# EAGLE schematic node6-gfe (EAGLE 6.5.0)

## Sheet 1 of 2: STM32, ENET
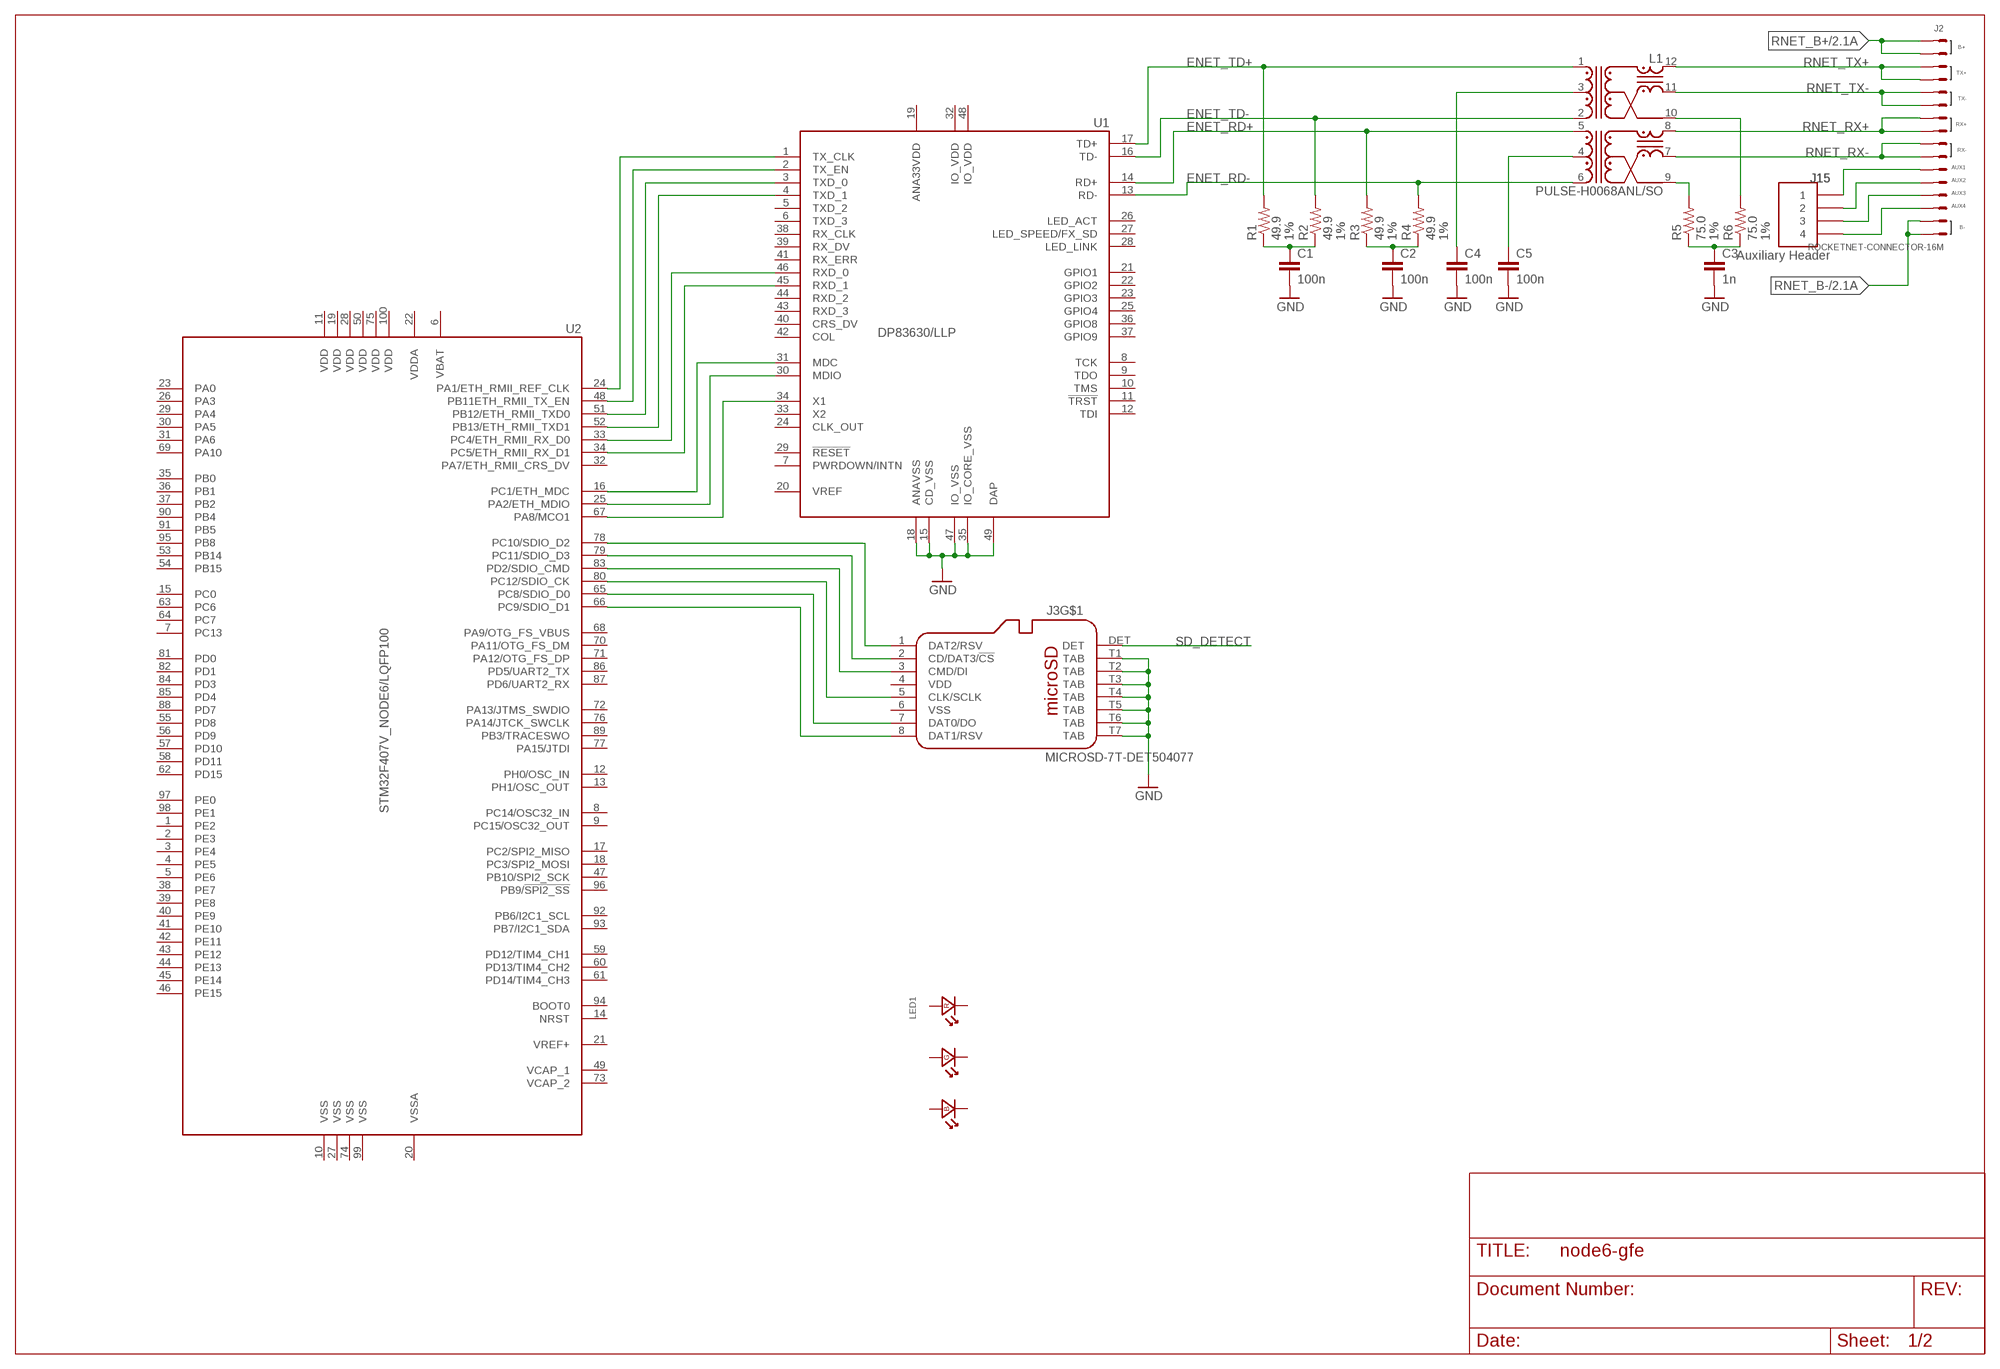
[diagram p0: schematic, sheet 1]

### Parts
C1  100n  C-EU0402-B-NOSILK  [0402-B-NOSILK]
C2  100n  C-EU0402-B-NOSILK  [0402-B-NOSILK]
C3  1n  C-EU0402-B-NOSILK  [0402-B-NOSILK]
C4  100n  C-EU0402-B-NOSILK  [0402-B-NOSILK]
C5  100n  C-EU0402-B-NOSILK  [0402-B-NOSILK]
J2  ROCKETNET-CONNECTOR-16M  [ROCKETNET-M-16]
J3  MICROSD-7T-DET504077  [MOLEX_504077-1891]
J15  Auxiliary Header  1.27MM_HDR_1X4  [INLINE]
L1  PULSE-H0068ANL/SO  [PULSE-H0068ANL]
LED1  LED_RGB_PLCC-6  [PLCC-6]
R1  49.9  R-US_0402-B-NOSILK  [0402-B-NOSILK]
R2  49.9  R-US_0402-B-NOSILK  [0402-B-NOSILK]
R3  49.9  R-US_0402-B-NOSILK  [0402-B-NOSILK]
R4  49.9  R-US_0402-B-NOSILK  [0402-B-NOSILK]
R5  75.0  R-US_0402-B-NOSILK  [0402-B-NOSILK]
R6  75.0  R-US_0402-B-NOSILK  [0402-B-NOSILK]
U1  DP83630/LLP  [QFN50P700X700X80-49N]
U2  STM32F407V_NODE6/LQFP100  [QFP50P1600X1600X160-100N]

### Nets
ENET_RD+: L1.5(TD+) R3.2 U1.14(RD+)
ENET_RD-: L1.6(TD-) R4.2 U1.13(RD-)
ENET_TD+: L1.1(RD+) R1.2 U1.17(TD+)
ENET_TD-: L1.2(RD-) R2.2 U1.16(TD-)
GND [PWR]: C1.2 C2.2 C3.2 C4.2 C5.2 J3.T1(TAB) J3.T2(TAB) J3.T3(TAB) J3.T4(TAB) J3.T5(TAB) J3.T6(TAB) J3.T7(TAB) U1.15(CD_VSS) U1.18(ANAVSS) U1.35(IO_CORE_VSS) U1.47(IO_VSS) U1.49(DAP) ; also sheet 2
N$3: U1.1(TX_CLK) U2.24(PA1/ETH_RMII_REF_CLK)
N$5: C1.1 R1.1 R2.1
N$7: L1.9(TXCT) R5.2
N$8: C2.1 R3.1 R4.1
N$9: L1.10(RXCT) R6.2
N$10: C3.1 R5.1 R6.1
N$11: C4.1 L1.3(RDCT)
N$12: C5.1 L1.4(TDCT)
N$13: U1.2(TX_EN) U2.48(PB11ETH_RMII_TX_EN)
N$14: U1.3(TXD_0) U2.51(PB12/ETH_RMII_TXD0)
N$15: U1.4(TXD_1) U2.52(PB13/ETH_RMII_TXD1)
N$16: U1.46(RXD_0) U2.33(PC4/ETH_RMII_RX_D0)
N$17: U1.45(RXD_1) U2.34(PC5/ETH_RMII_RX_D1)
N$18: U1.34(X1) U2.67(PA8/MCO1)
N$19: U1.30(MDIO) U2.25(PA2/ETH_MDIO)
N$20: U1.31(MDC) U2.16(PC1/ETH_MDC)
RNET_AUX1: J2.A1(AUX1) J15.1
RNET_AUX2: J2.A2(AUX2) J15.2
RNET_AUX3: J2.A3(AUX3) J15.3
RNET_AUX4: J2.A4(AUX4) J15.4
RNET_B+: J2.B+@15(B+) J2.B+@16(B+) ; also sheet 2
RNET_B-: J2.B-@1(B-) J2.B-@2(B-) ; also sheet 2
RNET_RX+: J2.R+@5(RX+) J2.R+@7(RX+) L1.8(TX+)
RNET_RX-: J2.R-@3(RX-) J2.R-@4(RX-) L1.7(TX-)
RNET_TX+: J2.T+@13(TX+) J2.T+@14(TX+) L1.12(RX+)
RNET_TX-: J2.T-@9(TX-) J2.T-@11(TX-) L1.11(RX-)
SD_CLK: J3.5(CLK/SCLK) U2.80(PC12/SDIO_CK)
SD_CMD: J3.3(CMD/DI) U2.83(PD2/SDIO_CMD)
SD_DAT0: J3.7(DAT0/DO) U2.65(PC8/SDIO_D0)
SD_DAT1: J3.8(DAT1/RSV) U2.66(PC9/SDIO_D1)
SD_DAT2: J3.1(DAT2/RSV) U2.78(PC10/SDIO_D2)
SD_DAT3: J3.2(CD/DAT3/!CS) U2.79(PC11/SDIO_D3)
SD_DETECT: J3.DET
Unconnected: LED1.1(R:A) LED1.2(G:K) LED1.3(G:A) LED1.4(B:A) LED1.5(B:K) LED1.6(R:K) U1.5(TXD_2) U1.6(TXD_3) U1.7(PWRDOWN/INTN) U1.8(TCK) U1.9(TDO) U1.10(TMS) U1.11(!TRST) U1.12(TDI) U1.20(VREF) U1.21(GPIO1) U1.22(GPIO2) U1.23(GPIO3) U1.24(CLK_OUT) U1.25(GPIO4) U1.26(LED_ACT) U1.27(LED_SPEED/FX_SD) U1.28(LED_LINK) U1.29(!RESET) U1.33(X2) U1.36(GPIO8) U1.37(GPIO9) U1.38(RX_CLK) U1.39(RX_DV) U1.40(CRS_DV) U1.41(RX_ERR) U1.42(COL) U1.43(RXD_3) U1.44(RXD_2) U2.1(PE2) U2.2(PE3) U2.3(PE4) U2.4(PE5) U2.5(PE6) U2.6(VBAT) U2.7(PC13) U2.8(PC14/OSC32_IN) U2.9(PC15/OSC32_OUT) U2.10(VSS) U2.11(VDD) U2.12(PH0/OSC_IN) U2.13(PH1/OSC_OUT) U2.14(NRST) U2.15(PC0) U2.17(PC2/SPI2_MISO) U2.18(PC3/SPI2_MOSI) U2.19(VDD) U2.20(VSSA) U2.21(VREF+) U2.22(VDDA) U2.23(PA0) U2.26(PA3) U2.27(VSS) U2.28(VDD) U2.29(PA4) U2.30(PA5) U2.31(PA6) U2.32(PA7/ETH_RMII_CRS_DV) U2.35(PB0) U2.36(PB1) U2.37(PB2) U2.38(PE7) U2.39(PE8) U2.40(PE9) U2.41(PE10) U2.42(PE11) U2.43(PE12) U2.44(PE13) U2.45(PE14) U2.46(PE15) U2.47(PB10/SPI2_SCK) U2.49(VCAP_1) U2.50(VDD) U2.53(PB14) U2.54(PB15) U2.55(PD8) U2.56(PD9) U2.57(PD10) U2.58(PD11) U2.59(PD12/TIM4_CH1) U2.60(PD13/TIM4_CH2) U2.61(PD14/TIM4_CH3) U2.62(PD15) U2.63(PC6) U2.64(PC7) U2.68(PA9/OTG_FS_VBUS) U2.69(PA10) U2.70(PA11/OTG_FS_DM) U2.71(PA12/OTG_FS_DP) U2.72(PA13/JTMS_SWDIO) U2.73(VCAP_2) U2.74(VSS) U2.75(VDD) U2.76(PA14/JTCK_SWCLK) U2.77(PA15/JTDI) U2.81(PD0) U2.82(PD1) U2.84(PD3) U2.85(PD4) U2.86(PD5/UART2_TX) U2.87(PD6/UART2_RX) U2.88(PD7) U2.89(PB3/TRACESWO) U2.90(PB4) U2.91(PB5) U2.92(PB6/I2C1_SCL) U2.93(PB7/I2C1_SDA) U2.94(BOOT0) U2.95(PB8) U2.96(PB9/!SPI2_SS) U2.97(PE0) U2.98(PE1) U2.99(VSS) U2.100(VDD)

## Sheet 2 of 2: Power Supply
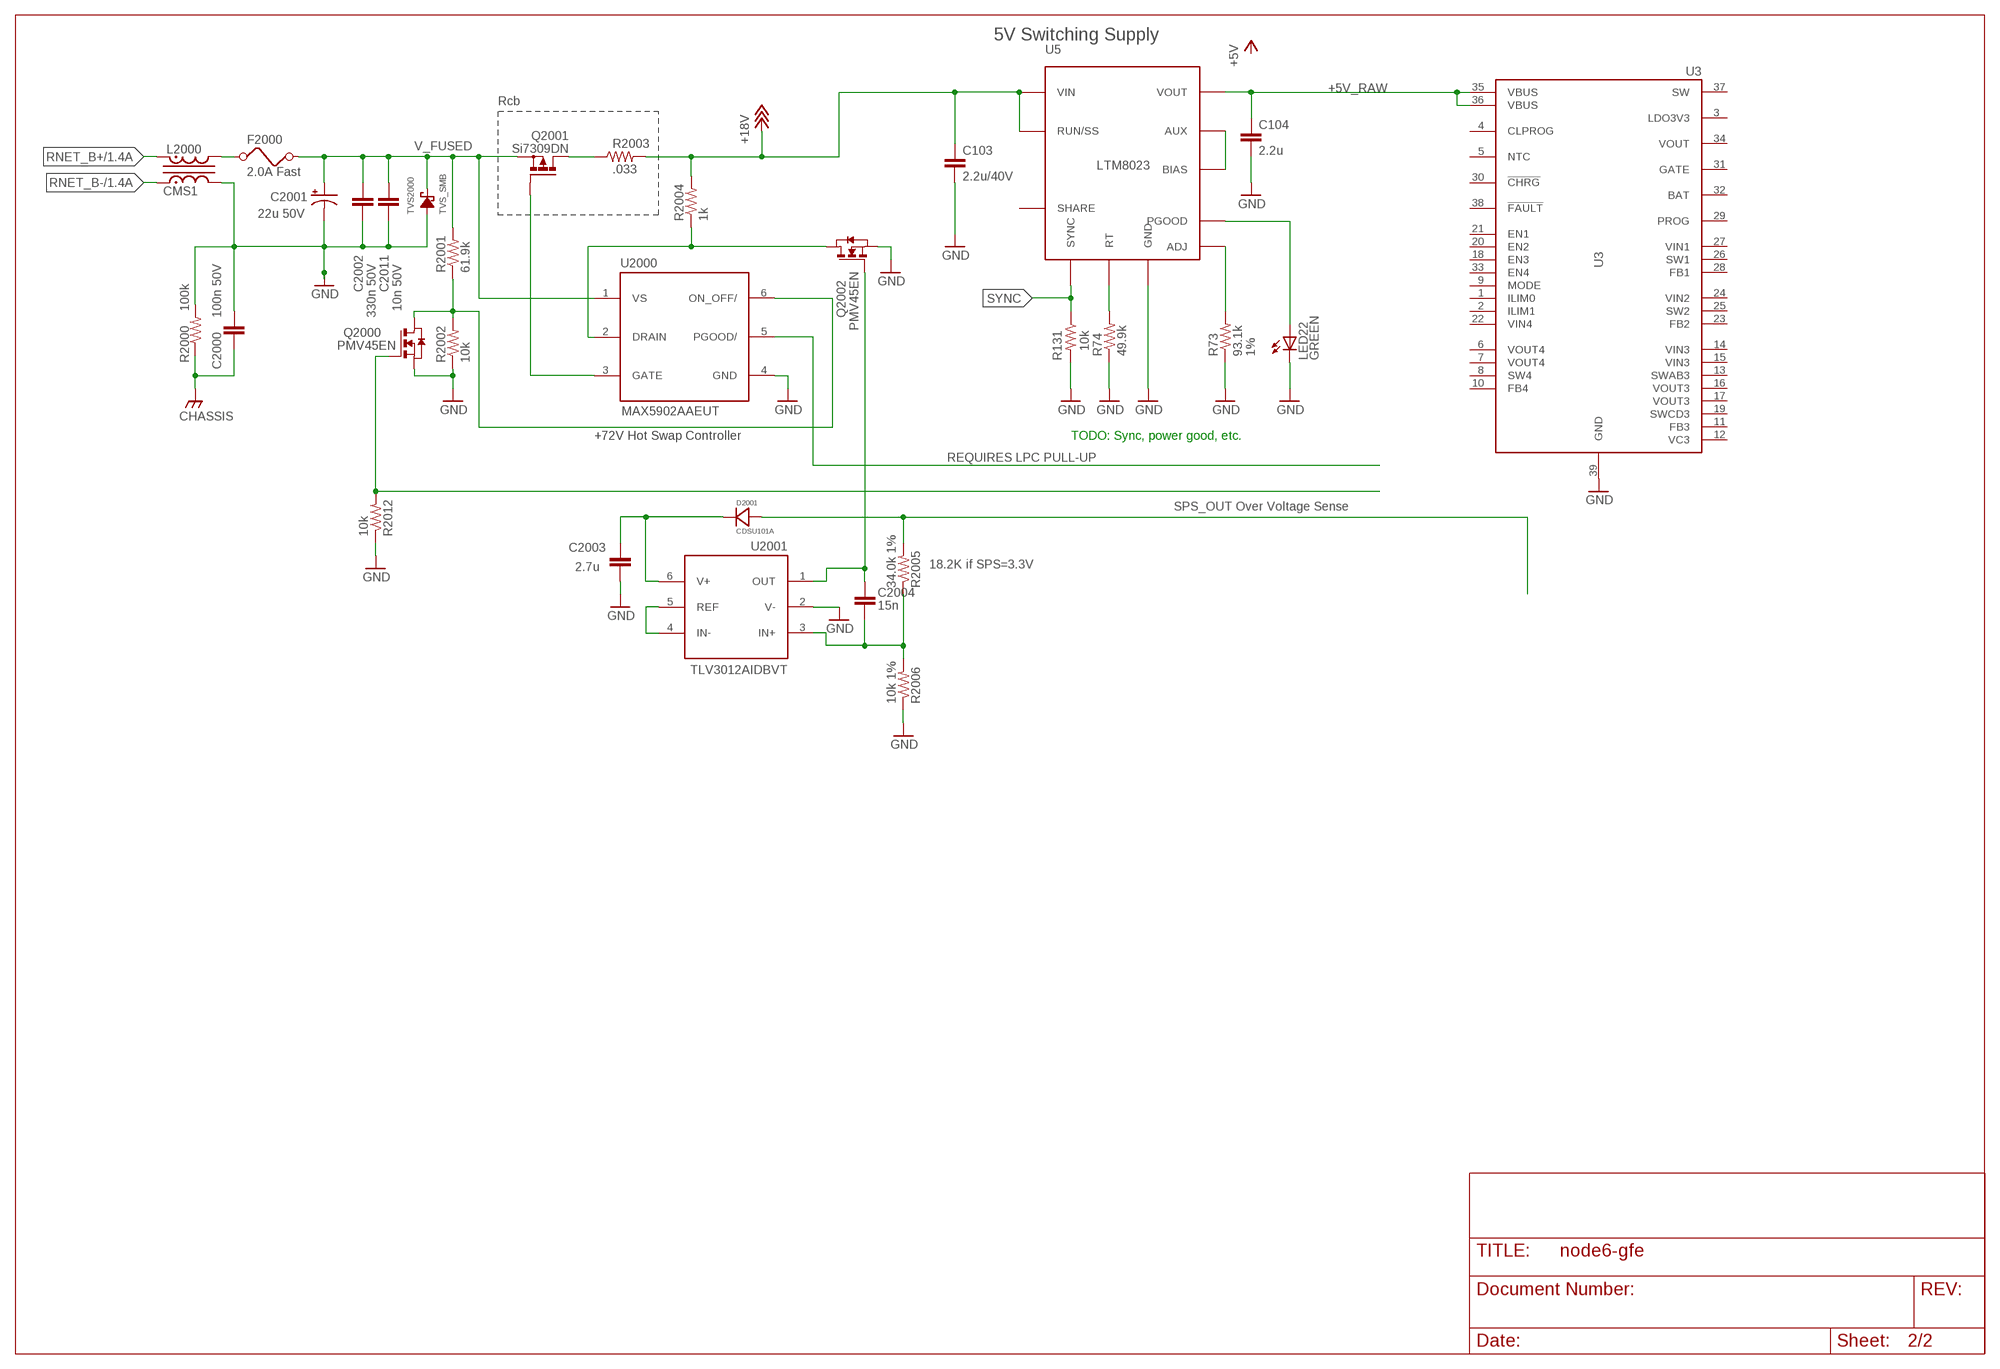
[diagram p1: schematic, sheet 2]

### Parts
C103  2.2u/40V  C-EU0603-B-NOSILK  [0603-B-NOSILK]
C104  2.2u  C-EU0603-B-NOSILK  [0603-B-NOSILK]
C2000  100n 50V  C-EU0603-B-NOSILK  [0603-B-NOSILK]
C2001  22u 50V  CPOL-USD/7343-31R  [D/7343-31R]
C2002  330n 50V  C-EU0603-B-NOSILK  [0603-B-NOSILK]
C2003  2.7u  C-EU0603-B-NOSILK  [0603-B-NOSILK]
C2004  15n  C-EU0603-B-NOSILK  [0603-B-NOSILK]
C2011  10n 50V  C-EU0603-B-NOSILK  [0603-B-NOSILK]
D2001  CDSU101A  DIODE_SILICON-0603  [0603-DIODE]
F2000  2.0A Fast  FUSE1206  [1206]
L2000  CMS1  COIL_CMS1  [CMS1]
LED22  GREEN  LEDCHIPLED_0603  [CHIPLED_0603]
Q2000  PMV45EN  [SOT23]
Q2001  Si7309DN  P-MOS_SI7123DN  [1212-8_POWERPAK]
Q2002  PMV45EN  [SOT23]
R73  93.1k  R-US_0402-B-NOSILK  [0402-B-NOSILK]
R74  49.9k  R-US_0402-B-NOSILK  [0402-B-NOSILK]
R131  10k  R-US_0402-B-NOSILK  [0402-B-NOSILK]
R2000  100k  R-US_0603-B-NOSILK  [0603-B-NOSILK]
R2001  61.9k  R-US_0603-B-NOSILK  [0603-B-NOSILK]
R2002  10k  R-US_0603-B-NOSILK  [0603-B-NOSILK]
R2003  .033  R-US_0805-B-NOSILK  [0805-B-NOSILK]
R2004  1k  R-US_0603-B-NOSILK  [0603-B-NOSILK]
R2005  34.0k 1%  R-US_0603-B-NOSILK  [0603-B-NOSILK]
R2006  10k 1%  R-US_0603-B-NOSILK  [0603-B-NOSILK]
R2012  10k  R-US_0603-B-NOSILK  [0603-B-NOSILK]
TVS2000  TVS_SMB  [DO-214AA/SMB]
U3  LTC3586  [QFN40P600X400X75-39N]
U5  LTM8023  [LGA-50]
U2000  MAX5902AAEUT  IC_MAX5902  [SOT23-6]
U2001  TLV3012AIDBVT  IC_TLV3012  [SOT23-6]

### Nets
+5V_RAW [PWR]: C104.1 U3.35(VBUS) U3.36(VBUS) U5.VOUT@1(VOUT) U5.VOUT@2(VOUT) U5.VOUT@3(VOUT) U5.VOUT@4(VOUT) U5.VOUT@5(VOUT) U5.VOUT@6(VOUT) U5.VOUT@7(VOUT) U5.VOUT@8(VOUT) U5.VOUT@9(VOUT) U5.VOUT@10(VOUT) U5.VOUT@11(VOUT) U5.VOUT@12(VOUT)
+18V [PWR]: C103.1 R2003.2 R2004.2 U5.RUN/SS U5.VIN@1(VIN) U5.VIN@2(VIN) U5.VIN@3(VIN) U5.VIN@4(VIN) U5.VIN@5(VIN) U5.VIN@6(VIN)
BIN: F2000.1 L2000.3
CHASSIS: C2000.1 R2000.1
GND [PWR]: C103.2 C104.2 C2000.2 C2001.- C2002.1 C2003.1 C2011.1 L2000.2 LED22.C Q2000.2(S) Q2002.2(S) R73.1 R74.1 R131.2 R2000.2 R2002.1 R2006.1 R2012.1 TVS2000.ANODE U3.39(GND) U5.GND@1(GND) U5.GND@2(GND) U5.GND@3(GND) U5.GND@4(GND) U5.GND@5(GND) U5.GND@6(GND) U5.GND@7(GND) U5.GND@8(GND) U5.GND@9(GND) U5.GND@10(GND) U5.GND@11(GND) U5.GND@12(GND) U5.GND@13(GND) U5.GND@14(GND) U5.GND@15(GND) U5.GND@16(GND) U5.GND@17(GND) U5.GND@18(GND) U5.GND@19(GND) U5.GND@20(GND) U5.GND@21(GND) U5.GND@22(GND) U5.GND@23(GND) U5.GND@24(GND) U2000.4(GND) U2001.2(V-) ; also sheet 1
IN+: C2004.1 R2005.1 R2006.2 U2001.3(IN+)
MAX_UVLO: Q2000.3(D) R2001.1 R2002.2 U2000.6(ON_OFF/)
N$37: U5.AUX U5.BIAS
N$116: R73.2 U5.ADJ
N$117: R74.2 U5.RT
N$334: Q2001.5-6-7-8(D) R2003.1
N_DRAIN: Q2002.3(D) R2004.1 U2000.2(DRAIN)
N_GATE: C2004.2 Q2002.1(G) U2001.1(OUT)
P_GATE: Q2001.4(G) U2000.3(GATE)
PGOOD_5V: LED22.A U5.PGOOD
PORT1.0/GPIO_SPS_DISABLE: Q2000.1(G) R2012.2
PORT1.1/GPIO_SPS_V-IN_GOOD: U2000.5(PGOOD/)
REF: U2001.4(IN-) U2001.5(REF)
RNET_B+: L2000.4 ; also sheet 1
RNET_B-: L2000.1 ; also sheet 1
SPS_OUT: D2001.A(ANODE) R2005.2
SYNC: R131.1 U5.SYNC
V+1: C2003.2 D2001.K(CATHODE) U2001.6(V+)
V_FUSED: C2001.+ C2002.2 C2011.2 F2000.2 Q2001.1-2-3(S) R2001.2 TVS2000.CATHODE U2000.1(VS)
Unconnected: U3.1(ILIM0) U3.2(ILIM1) U3.3(LDO3V3) U3.4(CLPROG) U3.5(NTC) U3.6(VOUT4) U3.7(VOUT4) U3.8(SW4) U3.9(MODE) U3.10(FB4) U3.11(FB3) U3.12(VC3) U3.13(SWAB3) U3.14(VIN3) U3.15(VIN3) U3.16(VOUT3) U3.17(VOUT3) U3.18(EN3) U3.19(SWCD3) U3.20(EN2) U3.21(EN1) U3.22(VIN4) U3.23(FB2) U3.24(VIN2) U3.25(SW2) U3.26(SW1) U3.27(VIN1) U3.28(FB1) U3.29(PROG) U3.30(!CHRG) U3.31(GATE) U3.32(BAT) U3.33(EN4) U3.34(VOUT) U3.37(SW) U3.38(!FAULT) U5.SHARE

### Notes on the sheet
- 5V Switching Supply
- Rcb
- +72V Hot Swap Controller | TODO: Sync, power good, etc.
- REQUIRES LPC PULL-UP
- SPS_OUT Over Voltage Sense
- 18.2K if SPS=3.3V

## Power pins joined to a net without a drawn wire
ANA33VDD: U1.19(ANA33VDD)
IO_VDD: U1.32(IO_VDD) U1.48(IO_VDD)
VDD: J3.4(VDD)
VSS: J3.6(VSS)

## Library data of the parts
C1-C5 C103 C104 C2000 C2002-C2004 C2011 = rcl_custom:C-EU: CAPACITOR, European symbol
C2001 = rcl:CPOL-US: POLARIZED CAPACITOR, American symbol
D2001 = psas_eagle_library:DIODE_SILICON-*: Generic Silicon Diode
F2000 = custom:FUSE: Fuse
J2 = rocketnet-connector:ROCKETNET-CONNECTOR-16
J3 = sd_card:MICROSD-7T-DET
J15 = headers:1.27MM_HDR_1X4
L1 = magnetics:PULSE-H0068ANL
L2000 = choke:COIL_CMS1: Coiltronics CMS1 series common mode choke
LED1 = LED_RGB_PLCC6:LED_RGB_*: RGB LED with separate contacts for all 3 chips
LED22 = led:LED: LED OSRAM: - CHIPLED LG R971, LG N971, LY N971, LG Q971, LY Q971, LO R971, LY R971 LH N974, LH R974 LS Q976, LO Q976, LY Q976 LO Q996 - Hyper CHIPLED LW Q18S LB Q993, LB Q99A, LB R99A - SideLED LS A670, LO A670, LY A670, LG A670, LP A670 LB A673, LV A673, LT A673, LW A673 LH A674 LY A675 LS A676, LA A676, LO A676, LY A676, LW A676 LS A679, LY A679, LG A679 - Hyper Micro SIDELED® LS Y876, LA Y876, LO Y876, LY Y876 LT Y87S - SmartLED LW L88C, LW L88S LB L89C, LB L89S, LG L890 LS L89K, LO L89K, LY L89K LS L896, LA L896, LO L896, LY L896 - TOPLED LS T670, LO T670, LY T670, LG T670, LP T670 LSG T670, LSP T670, LSY T670, LOP T670, LYG T670 LG T671, LOG T671, LSG T671 LB T673, LV T673, LT T673, LW T673 LH T674 LS T676, LA T676, LO T676, LY T676, LB T676, LH T676, LSB T676, LW T676 LB T67C, LV T67C, LT T67C, LS T67K, LO T67K, LY T67K, LW E67C LS E67B, LA E67B, LO E67B, LY E67B, LB E67C, LV E67C, LT E67C LW T67C LS T679, LY T679, LG T679 LS T770, LO T770, LY T770, LG T770, LP T770 LB T773, LV T773, LT T773, LW T773 LH T774 LS E675, LA E675, LY E675, LS T675 LS T776, LA T776, LO T776, LY T776, LB T776 LHGB T686 LT T68C, LB T68C - Hyper Mini TOPLED® LB M676 - Mini TOPLED Santana® LG M470 LS M47K, LO M47K, LY M47K Source: http://www.osram.convergy.de LUXEON: - LUMILED® LXK2-PW12-R00, LXK2-PW12-S00, LXK2-PW14-U00, LXK2-PW14-V00 LXK2-PM12-R00, LXK2-PM12-S00, LXK2-PM14-U00 LXK2-PE12-Q00, LXK2-PE12-R00, LXK2-PE12-S00, LXK2-PE14-T00, LXK2-PE14-U00 LXK2-PB12-K00, LXK2-PB12-L00, LXK2-PB12-M00, LXK2-PB14-N00, LXK2-PB14-P00, LXK2-PB14-Q00 LXK2-PR12-L00, LXK2-PR12-M00, LXK2-PR14-Q00, LXK2-PR14-R00 LXK2-PD12-Q00, LXK2-PD12-R00, LXK2-PD12-S00 LXK2-PH12-R00, LXK2-PH12-S00 LXK2-PL12-P00, LXK2-PL12-Q00, LXK2-PL12-R00 Source: www.luxeon.com KINGBRIGHT: KA-3528ASYC Source: www.kingbright.com
Q2000 Q2002 = Tova:PMV45EN
Q2001 = 0kaz:P-MOS_SI7123DN: P-MOSFET Vishay Siliconx Si7123 Rdson = 10.6 milliOhm at Vgs = -4.5V Vds max = -20V, Vgs max +- 8V, Id max = 25A, Pd max = 52W, Tj max = 33C/W
R1-R6 R73 = rcl_custom:R-US_: RESISTOR, American symbol; TOLERANCE: 1%
R74 R131 R2000-R2006 R2012 = rcl_custom:R-US_: RESISTOR, American symbol
TVS2000 = 0kaz:TVS_SMB
U1 = DP83630:DP83630
U2 = stm32:STM32F407V_NODE6
U3 = regulator:LTC3586
U5 = RNH_LTM8023:LTM8023
U2000 = node4:IC_MAX5902: MAX5902 Hot swap controller
U2001 = node4:IC_TLV3012: TLV3012 Nano power comparator with voltage reference

## Net classes
0 default: width 0.127 mm, drill 0.203 mm, clearance 0.127 mm
1 PWR: width 0.127 mm, drill 0.203 mm, clearance 0.127 mm to class 0, clearance 0.127 mm